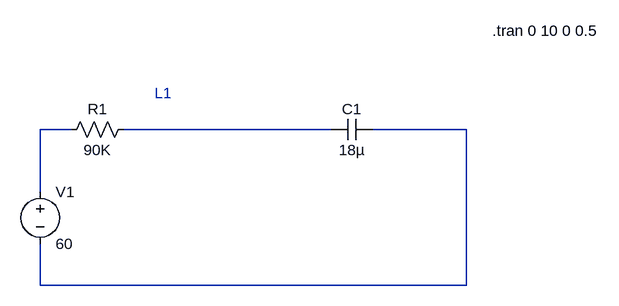
[diagram p0: schematic EJ5_teoría.asc]
EJ5_teoría.asc, the LTspice schematic file:
Version 4.1
SHEET 1 920 680
WIRE 80 -192 32 -192
WIRE 480 -192 160 -192
WIRE 688 -192 544 -192
WIRE 32 -96 32 -192
WIRE 32 48 32 -16
WIRE 688 48 688 -192
WIRE 688 48 32 48
SYMBOL voltage 32 -112 R0
SYMATTR InstName V1
SYMATTR Value 60
SYMBOL res 176 -208 R90
WINDOW 0 0 56 VBottom 2
WINDOW 3 32 56 VTop 2
SYMATTR InstName R1
SYMATTR Value 90K
SYMBOL cap 544 -208 R90
WINDOW 0 0 32 VBottom 2
WINDOW 3 32 32 VTop 2
SYMATTR InstName C1
SYMATTR Value 18µ
TEXT 208 -248 Left 2 ;L1
TEXT 728 -344 Left 2 !.tran 0 10 0 0.5

The netlist it stands for:
* EJ5_teoría.asc
V1 N001 N003 60
R1 N002 N001 90K
C1 N003 N002 18µ
* L1
.tran 0 10 0 0.5
.backanno
.end